# EAGLE design nrf52_pcb_layout (EAGLE 7.2.0)
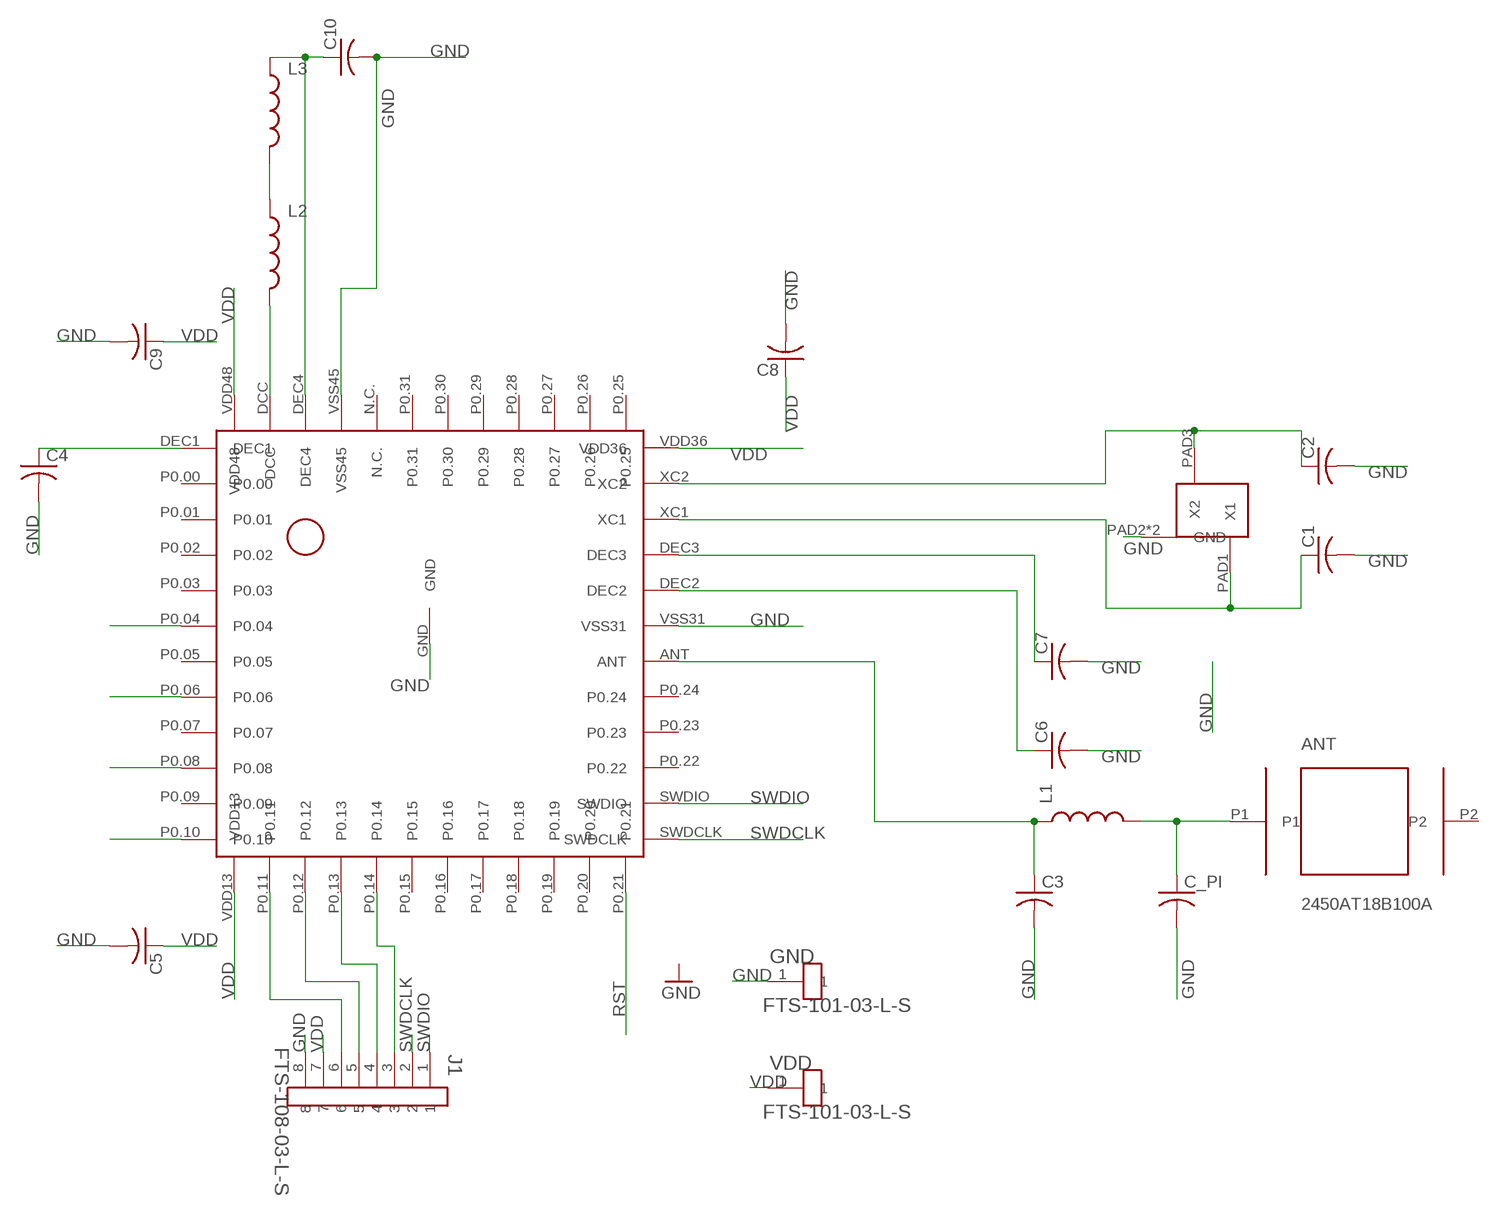
[diagram p0: schematic, sheet 1]

## Parts
ANT  2450AT18B100A  [2450AT18B100]
C1  C-USC0402  [C0402]
C2  C-USC0402  [C0402]
C3  C-USC0402  [C0402]
C4  C-USC0402  [C0402]
C5  C-USC0402  [C0402]
C6  C-USC0402  [C0402]
C7  C-USC0402  [C0402]
C8  C-USC0402  [C0402]
C9  C-USC0603  [C0603]
C10  C-USC0603  [C0603]
C_PI  C-USC0402  [C0402]
GND  FTS-101-03-L-S  [SAMTEC_FTS-101-03-S]
J1  FTS-108-03-L-S  [SAMTEC_FTS-108-03-S]
L1  INDUCTOR0402  [C0402]
L2  INDUCTOR0603  [0603]
L3  INDUCTOR0402  [C0402]
NRF52  NRF52832-QFN48  [NRF52832-QFN48]
U$1  EPSON-FA-128-32MHZ  [EPSON-FA-128-32MHZ]
VDD  FTS-101-03-L-S  [SAMTEC_FTS-101-03-S]

## Nets
GND: C1.2 C2.2 C3.2 C4.2 C5.2 C6.2 C7.2 C8.2 C9.2 C10.2 C_PI.2 GND.1 J1.8 NRF52.GND NRF52.VSS31 NRF52.VSS45 U$1.PAD2(GND) U$1.PAD4(GND)
N$1: ANT.P1 C_PI.1 L1.2
N$2: L2.1 L3.2
N$3: C4.1 NRF52.DEC1
N$4: L2.2 NRF52.DCC
N$5: C10.1 L3.1 NRF52.DEC4
N$6: C2.1 NRF52.XC2 U$1.PAD3(X2)
N$7: C1.1 NRF52.XC1 U$1.PAD1(X1)
N$8: J1.6 NRF52.P0.11
N$9: J1.5 NRF52.P0.12
N$10: J1.4 NRF52.P0.13
N$11: J1.3 NRF52.P0.14
N$12: C3.1 L1.1 NRF52.ANT
N$13: C7.1 NRF52.DEC3
N$14: C6.1 NRF52.DEC2
N$25: NRF52.P0.06
N$26: NRF52.P0.08
N$27: NRF52.P0.10
P4: NRF52.P0.04
RST: NRF52.P0.21
SWDCLK: J1.2 NRF52.SWDCLK
SWDIO: J1.1 NRF52.SWDIO
VDD: C5.1 C8.1 C9.1 J1.7 NRF52.VDD13 NRF52.VDD36 NRF52.VDD48 VDD.1
Unconnected: ANT.P2 NRF52.N.C. NRF52.P0.00 NRF52.P0.01 NRF52.P0.02 NRF52.P0.03 NRF52.P0.05 NRF52.P0.07 NRF52.P0.09 NRF52.P0.15 NRF52.P0.16 NRF52.P0.17 NRF52.P0.18 NRF52.P0.19 NRF52.P0.20 NRF52.P0.22 NRF52.P0.23 NRF52.P0.24 NRF52.P0.25 NRF52.P0.26 NRF52.P0.27 NRF52.P0.28 NRF52.P0.29 NRF52.P0.30 NRF52.P0.31

## Library data of the parts
ANT = antenna:2450AT18B100: 2.45 GHz chip antenna
C1-C10 C_PI = resistor:C-US: CAPACITOR, American symbol
GND VDD = samtec_fts:FTS-101-03-L-S
J1 = samtec_fts:FTS-108-03-L-S: CONN HEADER, 1.27MM, VERTICAL THT, 16WAY; MPN: FTS-108-03-L-D; OC_FARNELL: 1929684; OC_NEWARK: 11P4665; PACKAGE: HEADER, 1.27MM, VERTICAL THT, 16WAY; SUPPLIER: Samtec
L1-L3 = SparkFun:INDUCTOR: Inductors Basic Inductor/Choke - 0603 and 1206. Footprints are not proven and vary greatly between part numbers.
NRF52 = nordic-board:NRF52832-QFN48
U$1 = Epson Crystals:EPSON-FA-128-32MHZ

## Board
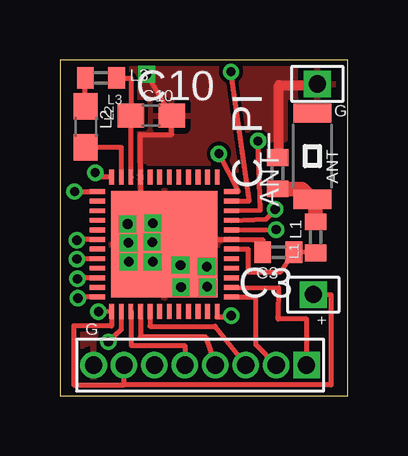
[diagram p1: board, top side]
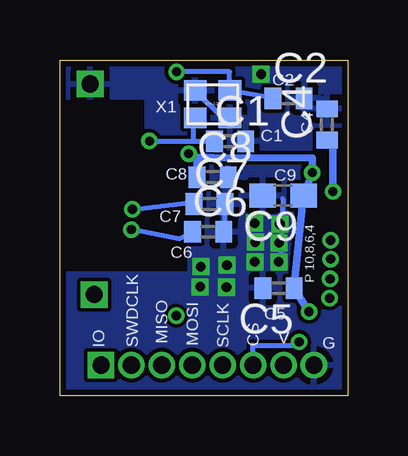
[diagram p2: board, bottom side, seen from below]

Size 12 x 14 mm. Coordinates in mm from the lower left corner, seen from the top.
Outline: 0,0 12,0 12,14 0,14 0,0
Copper layers (1*16): Top 0.035mm / dielectric 1.5mm / Bottom 0.035mm
Design rules "MF_Standard_2_Layer": minimum track width 6mil, minimum drill 12mil, track to track 6mil, track to pad 6mil, pad to pad 6mil, via to via 6mil, smd to smd 0mil, copper to edge 10mil, drill to drill 10mil, minimum pad ring 6mil, minimum via ring 6mil, stop-mask expansion 2mil, vias tented up to drill 25mil, thermal gap 10mil

### Footprints (pad centres in the part's own frame; a part is rotated, then mirrored left to right if it is on the bottom)
2450AT18B100 = smd 0.8 x 1.6: P1 -1.8,0; P2 1.8,0
C0402 = smd 0.7 x 0.9: 1 -0.65,0; 2 0.65,0
C0603 = smd 1.1 x 1: 1 -0.85,0; 2 0.85,0
SAMTEC_FTS-101-03-S = drill 0.711 pad 1.118 square: 1 0,0
SAMTEC_FTS-108-03-S = drill 0.711 pad 1.118 square: 1 0,0 | drill 0.711 pad 1.118: 2 1.27,0; 3 2.54,0; 4 3.81,0; 5 5.08,0; 6 6.35,0; 7 7.62,0; 8 8.89,0
0603 = smd 1.1 x 1: 1 -0.85,0; 2 0.85,0
NRF52832-QFN48 = smd 0.635 x 0.2: ANT 2.8,-0.2; DEC1 -2.8,2.2; DEC2 2.8,0.6; DEC3 2.8,1; P0.00 -2.8,1.8; P0.01 -2.8,1.4; P0.02 -2.8,1; P0.03 -2.8,0.6; P0.04 -2.8,0.2; P0.05 -2.8,-0.2; P0.06 -2.8,-0.6; P0.07 -2.8,-1; P0.08 -2.8,-1.4; P0.09 -2.8,-1.8; P0.10 -2.8,-2.2; P0.22 2.8,-1.4; P0.23 2.8,-1; P0.24 2.8,-0.6; SWDCLK 2.8,-2.2; SWDIO 2.8,-1.8; VDD36 2.8,2.2; VSS31 2.8,0.2; XC1 2.8,1.4; XC2 2.8,1.8 | smd 0.2 x 0.635: DCC -1.8,2.8; DEC4 -1.4,2.8; N.C. -0.6,2.8; P0.11 -1.8,-2.8; P0.12 -1.4,-2.8; P0.13 -1,-2.8; P0.14 -0.6,-2.8; P0.15 -0.2,-2.8; P0.16 0.2,-2.8; P0.17 0.6,-2.8; P0.18 1,-2.8; P0.19 1.4,-2.8; P0.20 1.8,-2.8; P0.21 2.2,-2.8; P0.25 2.2,2.8; P0.26 1.8,2.8; P0.27 1.4,2.8; P0.28 1,2.8; P0.29 0.6,2.8; P0.30 0.2,2.8; P0.31 -0.2,2.8; VDD13 -2.2,-2.8; VDD48 -2.2,2.8; VSS45 -1,2.8 | smd 4.445 x 4.445: GND 0,0
EPSON-FA-128-32MHZ = smd 0.95 x 0.85: PAD1 0.325,0.225; PAD2 1.775,0.225; PAD3 1.775,1.375; PAD4 0.325,1.375

### Placement (x,y rotation side)
ANT  10.53,9.99 90 top
C1  4.9,10.61 0 bottom
C2  2.46,12.4 0 bottom
C3  9.11,5.98 180 top
C4  0.86,11.31 90 bottom
C5  2.88,4.48 180 bottom
C6  5.82,6.83 0 bottom
C7  5.76,7.99 0 bottom
C8  5.63,9.11 0 bottom
C9  2.69,8.35 180 bottom
C10  3.81,11.67 0 top
C_PI  9.08,9.27 90 top
GND  10.74,13 90 top
J1  10.29,1.27 180 top
L1  10.67,6.6 90 top
L2  1.08,11.21 270 top
L3  1.71,13.25 180 top
NRF52  4.36,6.31 0 top
U$1  6.68,11.35 0 bottom
VDD  10.57,4.21 90 top

### Tracks (layer width: path | path; a pad name or v marks a point on that pad's centre or on a via)
GND  (via drill 0.41)
  Top 0.2: NRF52.VSS45 3.36,10.89 4.66,10.89 C10.2 | 5,12.01 C10.2 | v5.03,5.44 5.97,6.5 NRF52.VSS31 8.46,6.51 C3.2 | v3.61,13.4 C10.2
  Top 0.203: NRF52.VSS45 3.36,8.53 C9.2 3.54,6.97 v3.85,6.4
  Top 0.406: C_PI.2 9.14,9.92 9.14,12.95 10.74,12.95 GND.1
  Bottom 0.2: C6.2 5.11,6.83 C7.2 | 2.7,8.2 2.78,5.98 v2.87,5.58
  Bottom 0.203: U$1.PAD4 5.21,11.58 U$1.PAD2
  other vias: 6.12,5.38 5.05,4.52 6.15,4.54 3.88,7.19 2.82,7.16 3.87,5.58 2.86,6.37
  pour Top: 2.03,4 7,5 7,7
  pour Bottom: 0,13.97 11.68,13.97 11.68,12.45 8.38,12.45 8.38,6.86 6.6,6.86 6.6,6.6 6.6,5.08 11.68,5.08 11.68,0 0,0
  pour Top: 0,0 11.68,0 11.68,5.33 6.6,5.33 6.6,6.6 6.6,6.86 8.38,6.86 8.38,10.41 8.38,10.67 9.4,10.67 9.4,12.19 9.4,12.45 11.43,12.45 11.43,14.22 0,14.22
N$1
  Top 0.61: L1.2 10.67,8.05 ANT.P1 10.09,8.62 C_PI.1
N$2
  Top 0.2: L2.1 1.06,12.06 L3.2
N$3  (via drill 0.38)
  Top 0.2: v0.61,8.51 NRF52.DEC1
  Bottom 0.305: v0.61,8.51 0.61,10.41 C4.1
N$4
  Top 0.2: L2.2 2.56,10.36 NRF52.DCC
N$5
  Top 0.2: 3.16,11.75 C10.1 | NRF52.DEC4 C10.1 | 3.16,11.74 C10.1 | L3.1 2.96,13.25 C10.1
N$6  (via drill 0.38)
  Top 0.2: NRF52.XC2 7.9,8.12 v7.13,13.51
  Bottom 0.203: C2.1 U$1.PAD3 4.92,13.5 v7.13,13.51
N$7  (via drill 0.38)
  Top 0.2: NRF52.XC1 8.36,7.73 v8.26,10.62
  Bottom 0.2: v8.26,10.62 6.44,10.61 C1.1
  Bottom 0.203: U$1.PAD1 6.44,11.5 6.44,10.61
N$8  (via drill 0.38)
  Top 0.2: NRF52.P0.11 2.56,2.74 v2.02,2.24
  Bottom 0.2: J1.6 3.95,2.1 2.16,2.1 v2.02,2.24
N$9
  Top 0.2: NRF52.P0.12 2.97,2.09 5.21,2.09 J1.5
N$10
  Top 0.2: NRF52.P0.13 3.36,2.46 6.07,2.46 J1.4
N$11
  Top 0.2: NRF52.P0.14 3.76,2.89 6.47,2.89 J1.3
N$12
  Top 0.2: NRF52.ANT 7.85,6.11 7.85,5.16 9.21,5.16 C3.1 | 9.68,6.01 C3.1 | L1.1 C3.1
N$13  (via drill 0.38)
  Top 0.2: NRF52.DEC3 8.62,7.37 v8.98,7.77
  Bottom 0.2: v8.98,7.77 6.41,8.08 C7.1
N$14  (via drill 0.38)
  Top 0.2: NRF52.DEC2 v9.02,6.92
  Bottom 0.2: C6.1 7.03,6.54 v9.02,6.92
N$15  (via drill 0.38)
  other vias: 0.71,6.48
N$16  (via drill 0.38)
  other vias: 0.71,5.69
N$17  (via drill 0.38)
  other vias: 0.73,4.87
N$18  (via drill 0.38)
  other vias: 0.75,4.06
N$19  (via drill 0.38)
  other vias: 7.15,3.33
N$20
  Top 0.203: 1.28,6.51 0.7,6.51 0.7,6.45
N$21
  Top 0.203: 1.28,5.71 0.72,5.71 0.72,5.67
N$22
  Top 0.203: 1.3,4.9 0.72,4.9 0.72,4.84
N$23
  Top 0.203: 1.28,4.11 0.74,4.11 0.74,4.05
N$24
  Top 0.203: 6.55,3.28 7.15,3.28 7.15,3.33
SWDCLK
  Top 0.203: NRF52.SWDCLK 8.16,4.11 8.16,2.13 J1.2
SWDIO
  Top 0.2: NRF52.SWDIO 9.12,4.5 9.1,3.31 9.1,3.19 10.29,3.19 J1.1
VDD  (via drill 0.38)
  Top 0.2: v1.61,3.5 NRF52.VDD13 2.15,2.9 0.58,2.9 | 0.58,2.9 0.58,2.91 | 0.58,2.9 0.58,0.44 2.67,0.44 | 2.67,0.44 J1.7 | VDD.1 11.31,4.21 11.31,0.44 2.67,0.44 | NRF52.VDD36 7.44,8.51 v6.63,10.09 | NRF52.VDD48 1.47,9.11 v1.47,9.3
  Bottom 0.305: v1.61,3.5 C5.1 C9.1 1.55,9.08 v1.47,9.3 1.47,9.91 5.65,9.92 | 5.65,9.92 6.58,9.91 v6.63,10.09 | 5.65,9.92 6.28,9.92 C8.1

### Text on the board
tPlace: L3 | C10 | G | L2 | ANT | L1 | C3 | G | +
bPlace: C2 | C4 | X1 | C1 | C9 | C8 | P 10,8,6,4 | C7 | C6 | C5 | G | V | CS | SCLK | MOSI | MISO | SWDCLK | IO